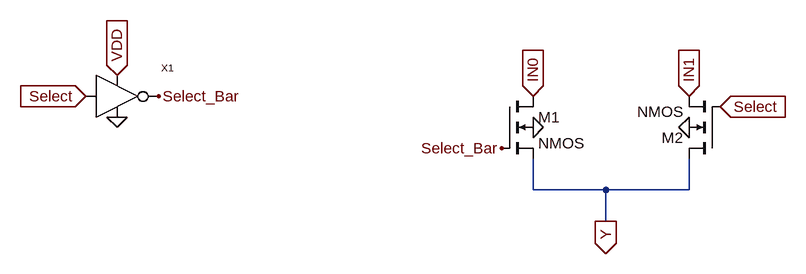
[diagram p0: schematic MUX_PTL.asc]
MUX_PTL.asc, the LTspice schematic file:
Version 4
SHEET 1 1428 680
WIRE 912 160 912 112
WIRE 1024 160 912 160
WIRE 1152 160 1152 112
WIRE 1152 160 1024 160
WIRE 1024 208 1024 160
FLAG 912 16 IN0
IOPIN 912 16 In
FLAG 1152 16 IN1
IOPIN 1152 16 In
FLAG 272 -16 VDD
IOPIN 272 -16 In
FLAG 272 48 0
FLAG 336 16 Select_Bar
FLAG 224 16 Select
IOPIN 224 16 In
FLAG 1200 32 Select
IOPIN 1200 32 In
FLAG 864 96 Select_Bar
FLAG 912 64 0
FLAG 1152 64 0
FLAG 1024 208 Y
IOPIN 1024 208 Out
SYMBOL nmos4 864 16 R0
SYMATTR InstName M1
SYMBOL nmos4 1200 112 R180
SYMATTR InstName M2
SYMBOL CMOS_Inverter 240 48 R0
SYMATTR InstName X1

The netlist it stands for:
* MUX_PTL.asc
M1 IN0 Select_Bar Y 0 NMOS
M2 Y Select IN1 0 NMOS
XX1 VDD 0 Select Select_Bar CMOS_Inverter  ; pins VPOS VNEG VIN VOUT
.model NMOS NMOS
.model PMOS PMOS
.lib standard.mos
.backanno
.end